# Altium schematic sheet MR_Power.SchDoc
size A4; CompanyName: BeeIonic; SheetNumber: 5; SheetTotal: 7
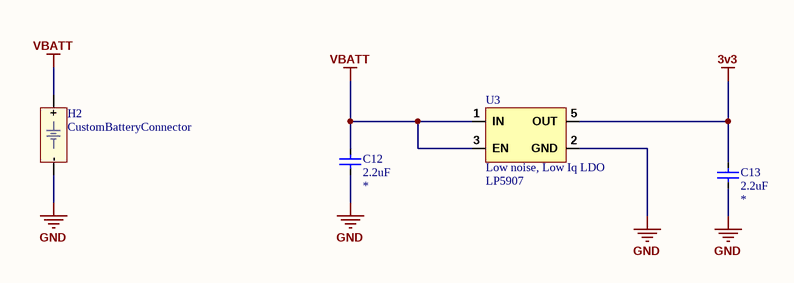
[diagram p0: MR_Power.SchDoc]

## Parts
C12  value 2.2uF  [0603_CAP_LD]  (hidden comment: CerCap)
C13  value 2.2uF  [0603_CAP_LD]  (hidden comment: CerCap)
H2  CustomBatteryConnector  [CustomBatteryConnector]
U3  Low noise, Low Iq LDO  [LP5907]

## Nets
3v3: C13.2 U3.5(OUT)
GND: C12.1 C13.1 H2.- U3.2(GND)
VBATT: C12.2 H2.+ U3.1(IN) U3.3(EN)

Not connected (* = marked no-connect by the designer): U3 4(NC)

## Notes on the sheet
- Project :
- Title :
- Sheet:
- of
- Creation Date :
- Designer :
- Modified Date :

## Library data of the parts
C12 C13 = CerCap: Ceramic Capacitor; Type: *; Voltage/Power: *; Package: *
H2 = BatteryConnector: Custom Battery Connector
U3 = LP5907: LP5907 Low Noise Low Iq LDO; Reference: LP5907